# Altium schematic sheet PanneauLed.SchDoc
size A3
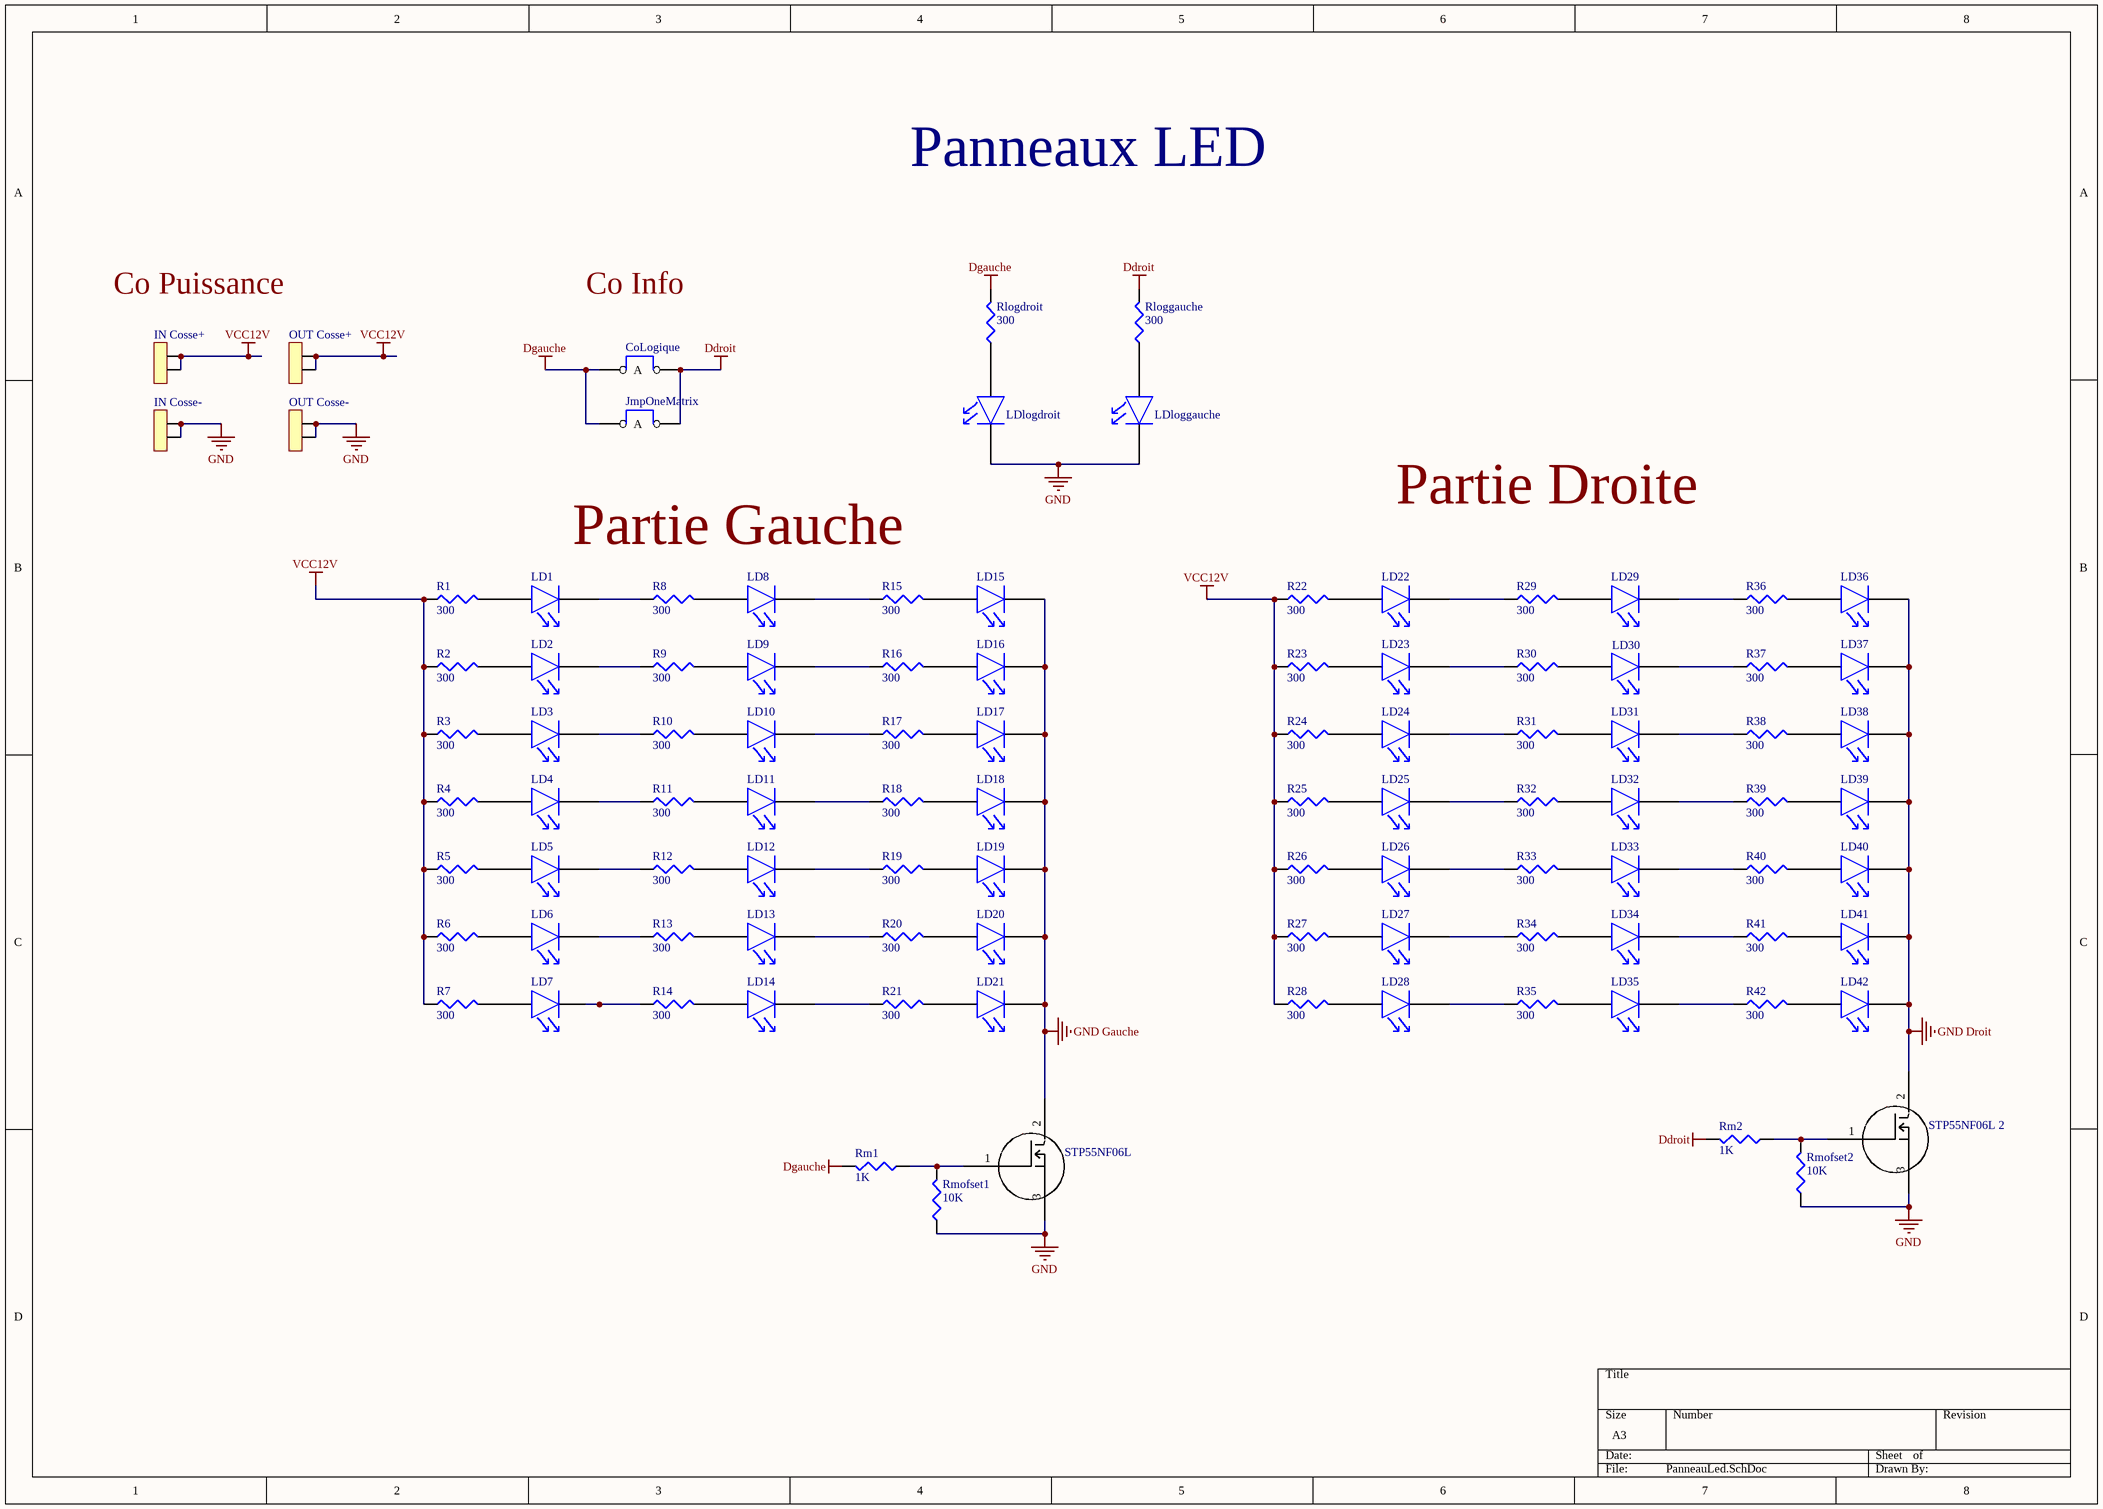
[diagram p0: PanneauLed.SchDoc]

## Parts
CoLogique  JUMPER2  [JMP2-100]  (value not drawn)
IN_Cosse+  comment  [POWER2]  (value not drawn)
IN_Cosse-  comment  [POWER2]  (value not drawn)
JmpOneMatrix  JUMPER2  [JMP2-100]  (value not drawn)
LD1  comment  [LED1206]  (value not drawn)
LD2  comment  [LED1206]  (value not drawn)
LD3  comment  [LED1206]  (value not drawn)
LD4  comment  [LED1206]  (value not drawn)
LD5  comment  [LED1206]  (value not drawn)
LD6  comment  [LED1206]  (value not drawn)
LD7  comment  [LED1206]  (value not drawn)
LD8  comment  [LED1206]  (value not drawn)
LD9  comment  [LED1206]  (value not drawn)
LD10  comment  [LED1206]  (value not drawn)
LD11  comment  [LED1206]  (value not drawn)
LD12  comment  [LED1206]  (value not drawn)
LD13  comment  [LED1206]  (value not drawn)
LD14  comment  [LED1206]  (value not drawn)
LD15  comment  [LED1206]  (value not drawn)
LD16  comment  [LED1206]  (value not drawn)
LD17  comment  [LED1206]  (value not drawn)
LD18  comment  [LED1206]  (value not drawn)
LD19  comment  [LED1206]  (value not drawn)
LD20  comment  [LED1206]  (value not drawn)
LD21  comment  [LED1206]  (value not drawn)
LD22  comment  [LED1206]  (value not drawn)
LD23  comment  [LED1206]  (value not drawn)
LD24  comment  [LED1206]  (value not drawn)
LD25  comment  [LED1206]  (value not drawn)
LD26  comment  [LED1206]  (value not drawn)
LD27  comment  [LED1206]  (value not drawn)
LD28  comment  [LED1206]  (value not drawn)
LD29  comment  [LED1206]  (value not drawn)
LD30  comment  [LED1206]  (value not drawn)
LD31  comment  [LED1206]  (value not drawn)
LD32  comment  [LED1206]  (value not drawn)
LD33  comment  [LED1206]  (value not drawn)
LD34  comment  [LED1206]  (value not drawn)
LD35  comment  [LED1206]  (value not drawn)
LD36  comment  [LED1206]  (value not drawn)
LD37  comment  [LED1206]  (value not drawn)
LD38  comment  [LED1206]  (value not drawn)
LD39  comment  [LED1206]  (value not drawn)
LD40  comment  [LED1206]  (value not drawn)
LD41  comment  [LED1206]  (value not drawn)
LD42  comment  [LED1206]  (value not drawn)
LDlogdroit  comment  [LED1206]  (value not drawn)
LDloggauche  comment  [LED1206]  (value not drawn)
OUT_Cosse+  (no value)  [POWER2]
OUT_Cosse-  comment  [POWER2]  (value not drawn)
R1  value 300  [0805]  (hidden comment: RES)
R2  value 300  [0805]  (hidden comment: RES)
R3  value 300  [0805]  (hidden comment: RES)
R4  value 300  [0805]  (hidden comment: RES)
R5  value 300  [0805]  (hidden comment: RES)
R6  value 300  [0805]  (hidden comment: RES)
R7  value 300  [0805]  (hidden comment: RES)
R8  value 300  [0805]  (hidden comment: RES)
R9  value 300  [0805]  (hidden comment: RES)
R10  value 300  [0805]  (hidden comment: RES)
R11  value 300  [0805]  (hidden comment: RES)
R12  value 300  [0805]  (hidden comment: RES)
R13  value 300  [0805]  (hidden comment: RES)
R14  value 300  [0805]  (hidden comment: RES)
R15  value 300  [0805]  (hidden comment: RES)
R16  value 300  [0805]  (hidden comment: RES)
R17  value 300  [0805]  (hidden comment: RES)
R18  value 300  [0805]  (hidden comment: RES)
R19  value 300  [0805]  (hidden comment: RES)
R20  value 300  [0805]  (hidden comment: RES)
R21  value 300  [0805]  (hidden comment: RES)
R22  value 300  [0805]  (hidden comment: RES)
R23  value 300  [0805]  (hidden comment: RES)
R24  value 300  [0805]  (hidden comment: RES)
R25  value 300  [0805]  (hidden comment: RES)
R26  value 300  [0805]  (hidden comment: RES)
R27  value 300  [0805]  (hidden comment: RES)
R28  value 300  [0805]  (hidden comment: RES)
R29  value 300  [0805]  (hidden comment: RES)
R30  value 300  [0805]  (hidden comment: RES)
R31  value 300  [0805]  (hidden comment: RES)
R32  value 300  [0805]  (hidden comment: RES)
R33  value 300  [0805]  (hidden comment: RES)
R34  value 300  [0805]  (hidden comment: RES)
R35  value 300  [0805]  (hidden comment: RES)
R36  value 300  [0805]  (hidden comment: RES)
R37  value 300  [0805]  (hidden comment: RES)
R38  value 300  [0805]  (hidden comment: RES)
R39  value 300  [0805]  (hidden comment: RES)
R40  value 300  [0805]  (hidden comment: RES)
R41  value 300  [0805]  (hidden comment: RES)
R42  value 300  [0805]  (hidden comment: RES)
Rlogdroit  value 300  [0805]  (hidden comment: RES)
Rloggauche  value 300  [0805]  (hidden comment: RES)
Rm1  value 1K  [0805]  (hidden comment: RES)
Rm2  value 1K  [0805]  (hidden comment: RES)
Rmofset1  value 10K  [0805]  (hidden comment: RES)
Rmofset2  value 10K  [0805]  (hidden comment: RES)
STP55NF06L  STP55NF06L  [STP55NF06L]  (value not drawn)
STP55NF06L_2  STP55NF06L  [STP55NF06L]  (value not drawn)

## Nets
Ddroit: CoLogique.2(com) JmpOneMatrix.2(com) Rloggauche.2 Rm2.2
Dgauche: CoLogique.1(A) JmpOneMatrix.1(A) Rlogdroit.2 Rm1.2
GND: IN_Cosse-.1 IN_Cosse-.2 LDlogdroit.K LDloggauche.K OUT_Cosse-.1 OUT_Cosse-.2 Rmofset1.1 Rmofset2.1 STP55NF06L.3 STP55NF06L_2.3
GND Droit: LD36.K LD37.K LD38.K LD39.K LD40.K LD41.K LD42.K STP55NF06L_2.2
GND Gauche: LD15.K LD16.K LD17.K LD18.K LD19.K LD20.K LD21.K STP55NF06L.2
VCC12V: IN_Cosse+.1 IN_Cosse+.2 OUT_Cosse+.1 OUT_Cosse+.2 R1.1 R2.1 R3.1 R4.1 R5.1 R6.1 R7.1 R22.1 R23.1 R24.1 R25.1 R26.1 R27.1 R28.1
NetLD1_A: LD1.A R1.2
NetLD1_K: LD1.K R8.1
NetLD2_A: LD2.A R2.2
NetLD2_K: LD2.K R9.1
NetLD3_A: LD3.A R3.2
NetLD3_K: LD3.K R10.1
NetLD4_A: LD4.A R4.2
NetLD4_K: LD4.K R11.1
NetLD5_A: LD5.A R5.2
NetLD5_K: LD5.K R12.1
NetLD6_A: LD6.A R6.2
NetLD6_K: LD6.K R13.1
NetLD7_A: LD7.A R7.2
NetLD7_K: LD7.K R14.1
NetLD8_A: LD8.A R8.2
NetLD8_K: LD8.K R15.1
NetLD9_A: LD9.A R9.2
NetLD9_K: LD9.K R16.1
NetLD10_A: LD10.A R10.2
NetLD10_K: LD10.K R17.1
NetLD11_A: LD11.A R11.2
NetLD11_K: LD11.K R18.1
NetLD12_A: LD12.A R12.2
NetLD12_K: LD12.K R19.1
NetLD13_A: LD13.A R13.2
NetLD13_K: LD13.K R20.1
NetLD14_A: LD14.A R14.2
NetLD14_K: LD14.K R21.1
NetLD15_A: LD15.A R15.2
NetLD16_A: LD16.A R16.2
NetLD17_A: LD17.A R17.2
NetLD18_A: LD18.A R18.2
NetLD19_A: LD19.A R19.2
NetLD20_A: LD20.A R20.2
NetLD21_A: LD21.A R21.2
NetLD22_A: LD22.A R22.2
NetLD22_K: LD22.K R29.1
NetLD23_A: LD23.A R23.2
NetLD23_K: LD23.K R30.1
NetLD24_A: LD24.A R24.2
NetLD24_K: LD24.K R31.1
NetLD25_A: LD25.A R25.2
NetLD25_K: LD25.K R32.1
NetLD26_A: LD26.A R26.2
NetLD26_K: LD26.K R33.1
NetLD27_A: LD27.A R27.2
NetLD27_K: LD27.K R34.1
NetLD28_A: LD28.A R28.2
NetLD28_K: LD28.K R35.1
NetLD29_A: LD29.A R29.2
NetLD29_K: LD29.K R36.1
NetLD30_A: LD30.A R30.2
NetLD30_K: LD30.K R37.1
NetLD31_A: LD31.A R31.2
NetLD31_K: LD31.K R38.1
NetLD32_A: LD32.A R32.2
NetLD32_K: LD32.K R39.1
NetLD33_A: LD33.A R33.2
NetLD33_K: LD33.K R40.1
NetLD34_A: LD34.A R34.2
NetLD34_K: LD34.K R41.1
NetLD35_A: LD35.A R35.2
NetLD35_K: LD35.K R42.1
NetLD36_A: LD36.A R36.2
NetLD37_A: LD37.A R37.2
NetLD38_A: LD38.A R38.2
NetLD39_A: LD39.A R39.2
NetLD40_A: LD40.A R40.2
NetLD41_A: LD41.A R41.2
NetLD42_A: LD42.A R42.2
NetLDlogdroit_A: LDlogdroit.A Rlogdroit.1
NetLDloggauche_A: LDloggauche.A Rloggauche.1
NetRm1_1: Rm1.1 Rmofset1.2 STP55NF06L.1
NetRm2_1: Rm2.1 Rmofset2.2 STP55NF06L_2.1

## Notes on the sheet
- Panneaux LED
- Co Puissance
- Co Info
- Partie Droite
- Partie Gauche

## Library data of the parts
CoLogique JmpOneMatrix = JUMPER2: cavalier 1 position
IN_Cosse+ IN_Cosse- OUT_Cosse+ OUT_Cosse- = POWER2: connecteur alim 2 pôles
LD1-LD42 LDlogdroit LDloggauche = LED: LED 5mm/3mm/CMS
R1-R42 Rlogdroit Rloggauche Rm1 Rm2 Rmofset1 Rmofset2 = RES: resistance